# EAGLE design BMS-Shield rev1 (EAGLE 8.1.0)
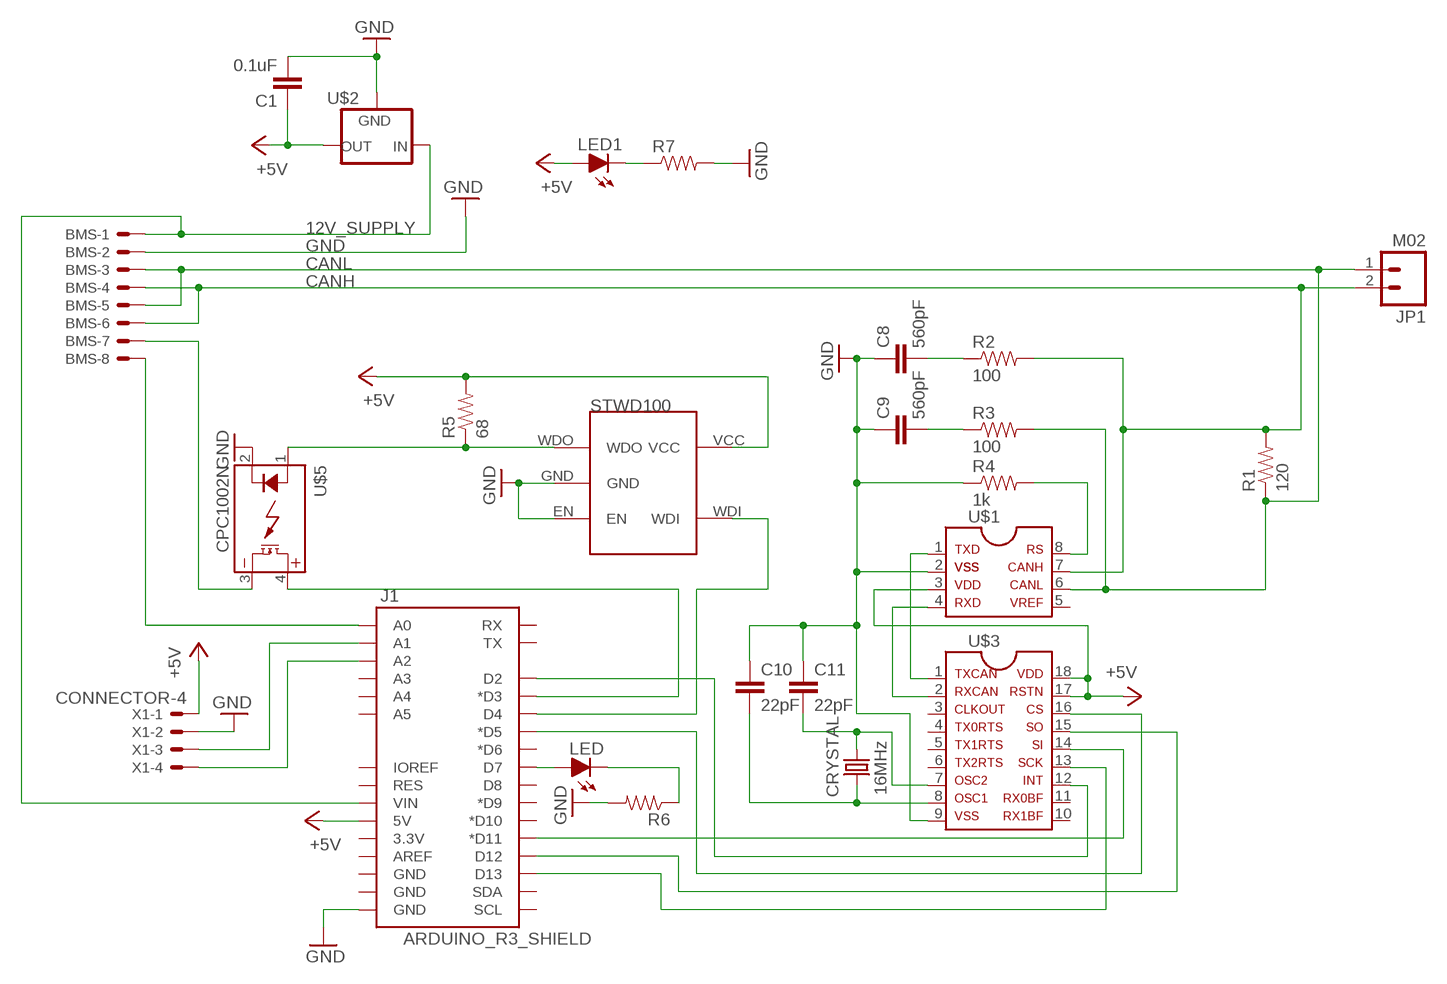
[diagram p0: schematic, sheet 1]

## Parts
BMS  MINIFIT_5566-8  [MINIFIT_5566-8]
C1  0.1uF  CAP0805  [0805]
C8  560pF  CAP0805  [0805]
C9  560pF  CAP0805  [0805]
C10  22pF  CAP0805  [0805]
C11  22pF  CAP0805  [0805]
CRYSTAL  16MHz  CRYSTALSMD  [HC49UP]
J1  ARDUINO_R3_SHIELD  [UNO_R3_SHIELD]
JP1  M02  [1X02]
LED  LED-0805  [LED-805]
LED1  LED-0805  [LED-805]
R1  120  RESISTOR0805-RES  [0805]
R2  100  RESISTOR0805-RES  [0805]
R3  100  RESISTOR0805-RES  [0805]
R4  1k  RESISTOR0805-RES  [0805]
R5  68  RESISTOR0805-RES  [0805]
R6  RESISTOR0805-RES  [0805]
R7  RESISTOR0805-RES  [0805]
U$1  MCP2551  [SOIC-08]
U$2  5VREG_LM340-NLM340MPX-5.0/NOPB  [SOT223]
U$3  MCP2515SMD  [SOIC-18W]
U$4  STWD100  [SOT23-5]
U$5  CPC1002N  [SOP04]
X1  CONNECTOR-4  [MINIFIT_5566-4]

## Nets
12V_SUPPLY: BMS.1 J1.VIN U$2.1(IN)
+5V: C1.1 J1.5V LED1.A R5.2 U$1.3 U$2.3(OUT) U$3.17 U$3.18 U$4.VCC X1.1
CANH: BMS.4 BMS.6 JP1.2 R1.2 R2.2 U$1.7
CANL: BMS.3 BMS.5 JP1.1 R1.1 R3.2 U$1.6
CS: J1.D5(*D5) U$3.16
GND: BMS.2 C1.2 C8.1 C9.1 C10.1 C11.1 J1.GND@0(GND) R4.1 R6.2 R7.2 U$1.2 U$2.2(GND) U$2.4(GND) U$3.9 U$4.EN U$4.GND U$5.2(CONTROL-) X1.2
N$1: BMS.8 J1.A0
N$2: J1.D12 U$3.15
N$3: J1.D11(*D11) U$3.14
N$4: J1.D13 U$3.13
N$5: R5.1 U$4.WDO U$5.1(CONTROL+)
N$6: J1.D4 U$4.WDI
N$7: J1.D7 LED.A
N$8: BMS.7 U$5.3(DC-)
N$9: J1.D3(*D3) U$5.4(DC+)
N$10: J1.D2 U$3.12
N$11: C10.2 CRYSTAL.2 U$3.8
N$12: U$1.1 U$3.1
N$13: U$1.4 U$3.2
N$14: C8.2 R2.1
N$15: C11.2 CRYSTAL.1 U$3.7
N$16: R4.2 U$1.8
N$17: C9.2 R3.1
N$18: LED.C R6.1
N$19: J1.A1 X1.3
N$20: J1.A2 X1.4
N$22: LED1.C R7.1
Unconnected: J1.3.3V J1.A3 J1.A4 J1.A5 J1.AREF J1.D6(*D6) J1.D8 J1.D9(*D9) J1.D10(*D10) J1.GND@1(GND) J1.GND@2(GND) J1.IOREF J1.RES J1.RX J1.SCL J1.SDA J1.TX U$1.5 U$3.3 U$3.4 U$3.5 U$3.6 U$3.10 U$3.11

## Library data of the parts
BMS = HyTechDevices:MINIFIT_5566-8: Mini-Fit Junior connector 8 pole Source: http://www.molex.com; OC_FARNELL: unknown; OC_NEWARK: unknown
C1 C8-C11 = HyTechDevices:CAP: Capacitor Standard 0603 ceramic capacitor, and 0.1" leaded capacitor.
CRYSTAL = SparkFun-FreqCtrl:CRYSTAL: Various standard crystals. Proven footprints.
J1 = HyTechDevices:ARDUINO_R3_SHIELD: Shield form compatible with the Arduino Uno R3. Source: Sparkfun <https://github.com/sparkfun/SparkFun-Eagle-Libraries>
JP1 = HyTechDevices:M02: Standard 2-pin 0.1" header. NOTES ON THE VARIANTS LOCK and LOCK_LONGPADS... This footprint was designed to help hold the alignment of a through-hole component (i.e. 6-pin header) while soldering it into place. You may notice that each hole has been shifted either up or down by 0.005 of an inch from it's more standard position (which is a perfectly straight line). This slight alteration caused the pins (the squares in the middle) to touch the edges of the holes. Because they are alternating, it causes a "brace" to hold the component in place. 0.005 has proven to be the perfect amount of "off-center" position when using our standard breakaway headers. Although looks a little odd when you look at the bare footprint, once you have a header in there, the alteration is very hard to notice. Also,if you push a header all the way into place, it is covered up entirely on the bottom side. This idea of altering the position of holes to aid alignment will be further integrated into the Sparkfun Library for other footprints. It can help hold any component with 3 or more connection pins. Note: The Sparkfun version includes many other packages including surface mount that may be of future interest. Source: Sparkfun <https://github.com/sparkfun/SparkFun-Eagle-Libraries>
LED LED1 = HyTechDevices:LED: Light Emitting Diode (LED) Source: Dangerous Prototypes Eagle Library <https://github.com/DangerousPrototypes/Eagle_Part_Library>
R1-R7 = HyTechDevices:RESISTOR: Resistor Basic schematic elements and footprints for 0603, 1206, and PTH resistors.
U$1 = HyTechDevices:MCP2551: MCP2551 High-Speed CAN Transceiver Product Webpage <https://www.microchip.com/wwwproducts/en/MCP2551> Datasheet <http://ww1.microchip.com/downloads/en/DeviceDoc/21667f.pdf> This device is outdated It is replaced by MCP2561. Comparison Page <https://www.microchip.com/wwwproducts/ProductCompare/MCP2551/MCP2561> Product Webpage <https://www.microchip.com/wwwproducts/en/MCP2561> Datasheet <http://ww1.microchip.com/downloads/en/DeviceDoc/20005167C.pdf>
U$2 = HyTechDevices:5VREG_LM340-N: Voltage Regulator 5v linear voltage regulator Datasheet <http://www.mouser.com/ProductDetail/Texas-Instruments/LM340MPX-50-NOPB/?qs=X1J7HmVL2ZGZwtTFRQ9ItA%3D%3D> MAX current out: 1.5A MAX voltage in: 35V
U$3 = HyTechDevices:MCP2515: MCP2515 CAN Controller with SPI Interface Datasheet <http://ww1.microchip.com/downloads/en/DeviceDoc/21801G.pdf>
U$4 = HyTechDevices:STWD100: STWD100 Watchdog timer
U$5 = HyTechDevices:CPC1002N: IXYS Solid State Relay .7A
X1 = HyTechDevices:CONNECTOR-4: Mini-Fit Junior connector 4 pole Source: http://www.molex.com; OC_FARNELL: unknown; OC_NEWARK: unknown

## Board
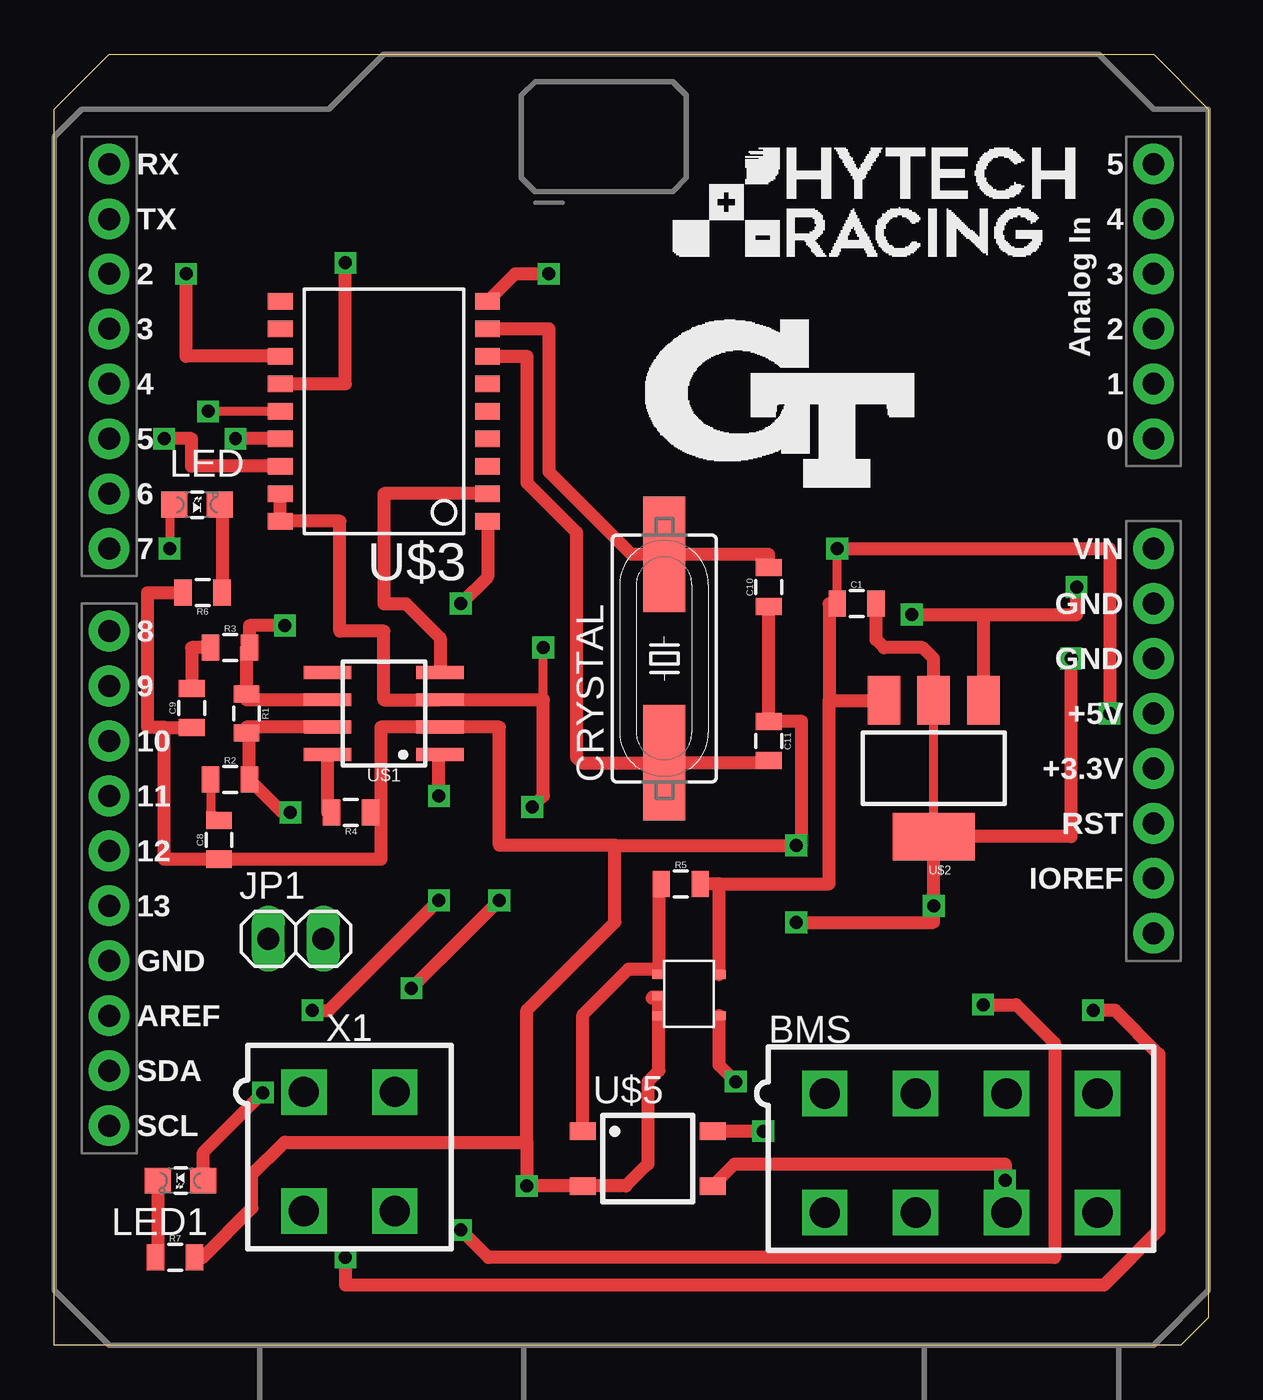
[diagram p1: board, top side]
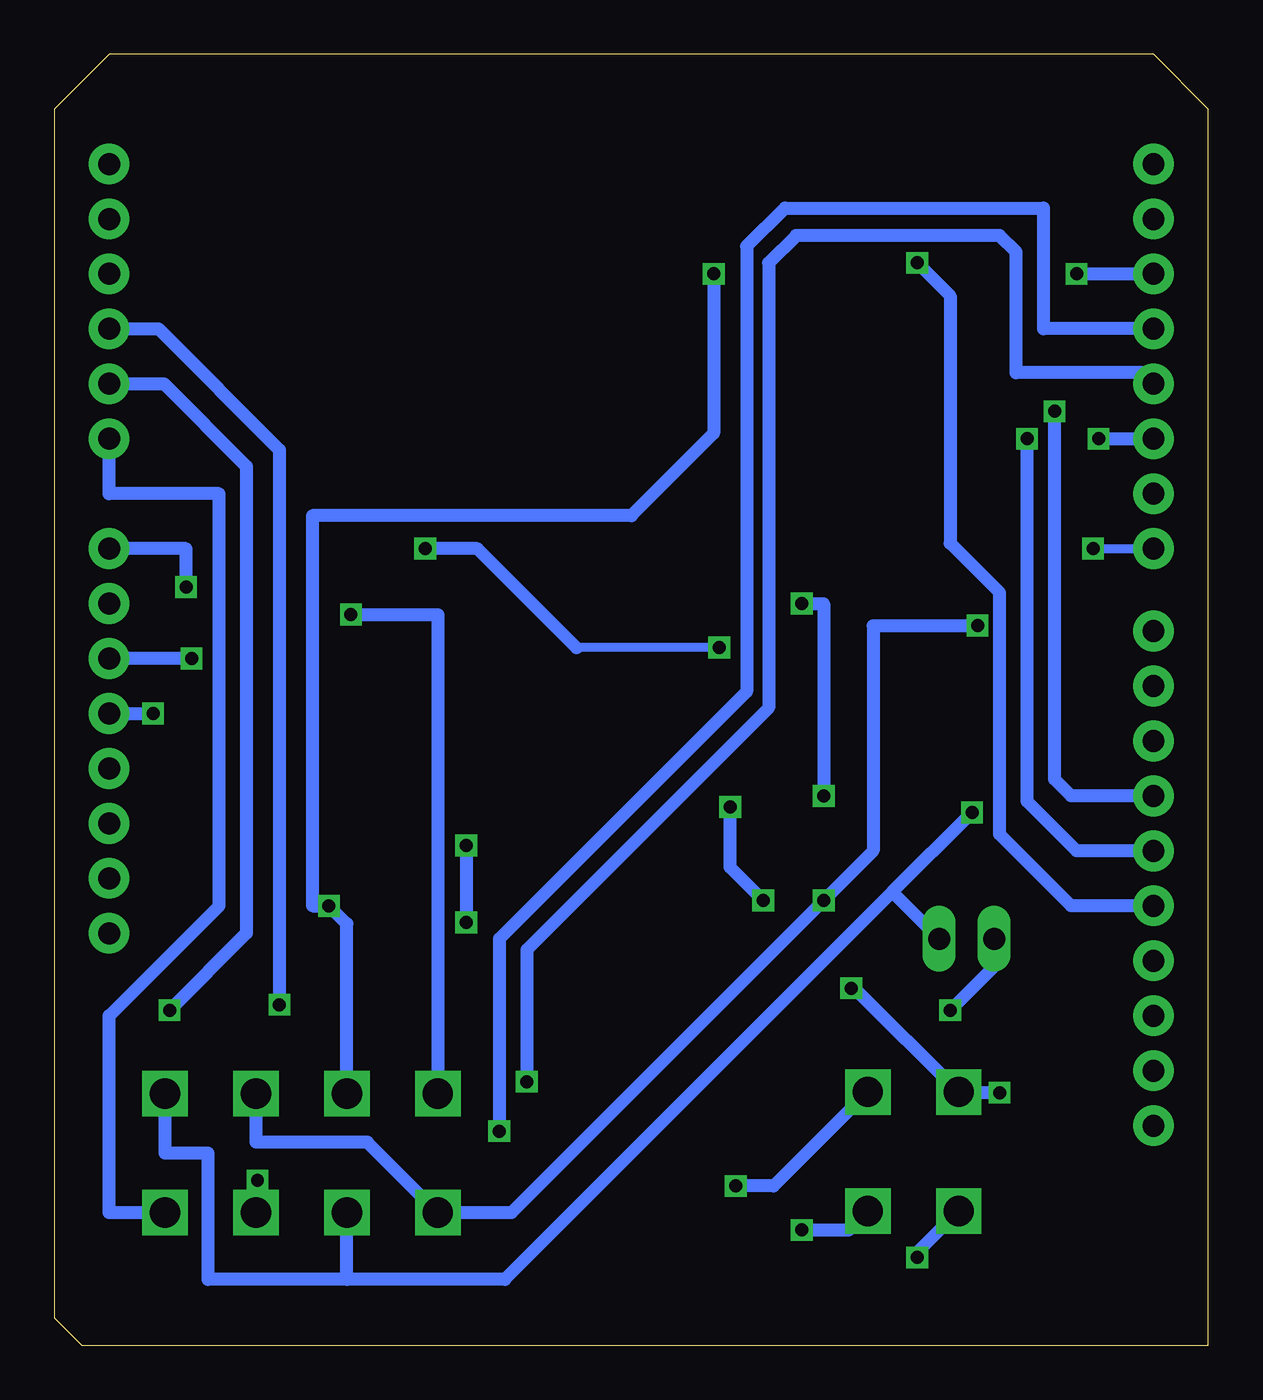
[diagram p2: board, bottom side, seen from below]

Size 53.34 x 59.69 mm. Coordinates in mm from the lower left corner, seen from the top.
Outline: 0,0 0,57.15 2.54,59.69 50.8,59.69 53.34,57.15 53.34,1.27 52.07,0 0,0
Copper layers (1*16): Top 0.035mm / dielectric 1.5mm / Bottom 0.035mm
Design rules "default": minimum track width 10mil, minimum drill 24mil, track to track 8mil, track to pad 8mil, pad to pad 8mil, via to via 8mil, smd to smd 8mil, copper to edge 40mil, drill to drill 8mil, minimum pad ring 10mil, minimum via ring 8mil, stop-mask expansion 4mil, vias tented up to drill 0mil, thermal gap 10mil

### Footprints (pad centres in the part's own frame; a part is rotated, then mirrored left to right if it is on the bottom)
MINIFIT_5566-8 = drill 1.4 square: 1 6.3,-2.75; 2 2.1,-2.75; 3 -2.1,-2.75; 4 -6.3,-2.75; 5 6.3,2.75; 6 2.1,2.75; 7 -2.1,2.75; 8 -6.3,2.75
0805 = smd 0.8 x 1.2: 1 -0.9,0; 2 0.9,0
HC49UP = smd 5.334 x 1.93: 1 -4.826,0; 2 4.826,0
UNO_R3_SHIELD = drill 1.016 pad 1.88: 3.3V 50.8,26.67; 5V 50.8,29.21; A0 50.8,41.91; A1 50.8,44.45; A2 50.8,46.99; A3 50.8,49.53; A4 50.8,52.07; A5 50.8,54.61; AREF 2.54,15.24; D2 2.54,49.53; D3 2.54,46.99; D4 2.54,44.45; D5 2.54,41.91; D6 2.54,39.37; D7 2.54,36.83; D8 2.54,33.02; D9 2.54,30.48; D10 2.54,27.94; D11 2.54,25.4; D12 2.54,22.86; D13 2.54,20.32; GND@0 50.8,31.75; GND@1 50.8,34.29; GND@2 2.54,17.78; IOREF 50.8,21.59; NC 50.8,19.05; RES 50.8,24.13; RX 2.54,54.61; SCL 2.54,10.16; SDA 2.54,12.7; TX 2.54,52.07; VIN 50.8,36.83
1X02 = drill 1.016 long: 1 -1.27,0; 2 1.27,0
LED-805 = smd 1.2 x 1.2: A 0,-1.05; C 0,1.05
SOIC-08 = smd 0.6 x 2.2: 1 -1.905,-2.6; 2 -0.635,-2.6; 3 0.635,-2.6; 4 1.905,-2.6; 5 1.905,2.6; 6 0.635,2.6; 7 -0.635,2.6; 8 -1.905,2.6
SOT223 = smd 1.5 x 2.235: 1 -2.3,-3.15; 2 0,-3.15; 3 2.3,-3.15 | smd 3.8 x 2.2: 4 0,3.15
SOIC-18W = smd 0.762 x 1.143: 1 -5.08,-4.788; 2 -3.81,-4.788; 3 -2.54,-4.788; 4 -1.27,-4.788; 5 0,-4.788; 6 1.27,-4.788; 7 2.54,-4.788; 8 3.81,-4.788; 9 5.08,-4.788; 10 5.08,4.788; 11 3.81,4.788; 12 2.54,4.788; 13 1.27,4.788; 14 0,4.788; 15 -1.27,4.788; 16 -2.54,4.788; 17 -3.81,4.788; 18 -5.08,4.788
SOT23-5 = smd 0.61 x 0.406: EN -2.794,0; GND -2.794,0.94; VCC 0,1.905; WDI 0,0; WDO -2.794,1.905
SOP04 = smd 0.8 x 1.2: 1 -1.27,-3; 2 1.27,-3; 3 1.27,3; 4 -1.27,3
MINIFIT_5566-4 = drill 1.4 square: 1 2.1,-2.75; 2 -2.1,-2.75; 3 2.1,2.75; 4 -2.1,2.75

### Placement (x,y rotation side)
BMS  41.91,8.89 180 top
C1  37.08,34.29 0 top
C8  7.62,23.37 90 top
C9  6.35,29.46 90 top
C10  33.02,35.05 90 top
C11  33.02,27.94 270 top
CRYSTAL  28.19,31.75 90 top
J1  0,0 0 top
JP1  11.18,18.8 0 top
LED  6.6,38.86 270 top
LED1  5.84,7.62 90 top
R1  8.89,29.21 270 top
R2  8.13,26.16 0 top
R3  8.13,32.26 0 top
R4  13.72,24.64 180 top
R5  28.96,21.34 0 top
R6  6.86,34.8 180 top
R7  5.59,4.06 0 top
U$1  15.24,29.21 90 top
U$2  40.64,26.67 180 top
U$3  15.24,43.18 90 top
U$4  30.73,15.24 0 top
U$5  27.43,8.64 270 top
X1  13.64,8.97 180 top

### Tracks (layer width: path | path; a pad name or v marks a point on that pad's centre or on a via)
12V_SUPPLY  (via drill 0.6)
  Top 0.61: v39.62,33.78 42.94,33.78 | 42.94,33.78 U$2.1 | 42.94,33.78 47.24,33.78 v47.24,35.05
  Bottom 0.61: v39.62,33.78 35.61,33.78 BMS.1 | v47.24,35.05 47.24,36.83 J1.VIN
+5V  (via drill 0.6)
  Top 0.406: U$2.3 38.47,29.82 | C1.1 v36.18,36.83 | 22.61,29.84 v22.61,32.26
  Top 0.61: U$4.VCC 30.73,21.34 | 30.73,21.34 R5.2 | 35.81,29.82 U$2.3 | 30.73,21.34 35.81,21.34 35.81,29.82 | U$3.17 U$3.18 13.21,38.1 13.21,33.02 15.24,33.02 15.24,29.84 U$1.3 22.61,29.84 22.61,25.4 v22.1,24.89 | C1.1 35.81,34.29 35.81,29.82 | v36.18,36.83 48.77,36.83 v48.77,29.21 | v16.51,16.51 v20.57,20.57 | LED1.A 6.89,8.92 v9.65,11.68
  Bottom 0.406: v22.61,32.26 29.21,32.26
  Bottom 0.61: v36.18,36.83 33.78,36.83 29.21,32.26 | J1.5V v48.77,29.21 | v16.51,16.51 16.33,16.51 X1.1 11.51,11.68 v9.65,11.68 | v20.57,20.57 22.1,22.1 v22.1,24.89
CANH  (via drill 0.6)
  Top 0.406: 8.89,28.57 R1.2 9.03,28.31 | v10.92,24.64 10.55,24.64
  Top 0.61: U$1.7 8.89,28.57 | 9.03,28.31 R2.2 10.55,24.64
  Bottom 0.61: 39.81,3.05 BMS.6 | BMS.4 48.21,8.89 46.23,8.89 46.23,3.05 39.81,3.05 | 14.61,20.95 v10.92,24.64 | 14.61,20.95 32.51,3.05 39.81,3.05 | JP1.2 14.61,20.95
CANL  (via drill 0.6)
  Top 0.406: R1.1 8.89,29.84 | R3.2 8.89,32.26
  Top 0.61: U$1.6 8.89,29.84 | 8.89,32.26 R1.1 | v10.67,33.27 9.03,33.27 R3.2 | v11.94,15.49 12.7,15.49 v17.78,20.57
  Bottom 0.61: BMS.3 44.01,9.4 38.87,9.4 BMS.5 32.21,6.14 v17.78,20.57 15.49,22.86 15.49,33.27 v10.67,33.27 | JP1.1 9.91,17.53 v11.94,15.49
CS  (via drill 0.6)
  Top 0.61: U$3.16 6.35,40.64 6.35,41.91 v5.08,41.91
  Bottom 0.61: v5.08,41.91 J1.D5
GND  (via drill 0.6)
  Top 0.406: 40.27,29.82 U$2.2 U$2.4 | 15.11,24.64 R4.1 | U$4.GND 27.64,16.18 27.64,16.05
  Top 0.61: v46.99,31.75 46.99,23.52 U$2.4 v40.64,20.32 40.64,19.56 v34.29,19.56 | C10.1 C11.1 34.54,28.84 34.54,23.11 v34.29,23.11 25.91,23.11 | 25.91,23.11 20.57,23.11 20.57,28.57 U$1.2 15.11,28.57 15.11,24.64 15.11,22.47 C8.1 5.08,22.47 5.08,28.56 | 21.84,9.4 v21.84,7.37 U$5.2 26.42,7.37 27.43,8.38 27.43,12.19 27.94,12.7 U$4.EN 27.94,16.05 27.64,16.05 | 21.84,9.4 21.84,15.49 25.91,19.56 25.91,23.11 | U$3.9 21.3,49.53 v22.86,49.53 | U$2.2 40.64,31.75 40.13,32.26 38.35,32.26 37.98,32.63 C1.2 | R6.2 4.32,34.8 4.32,28.56 5.08,28.56 | 5.08,28.56 C9.1 | R7.2 6.86,4.06 9.14,6.35 9.14,7.87 10.67,9.4 21.84,9.4
  Bottom 0.61: v46.99,31.75 J1.GND@0 | BMS.2 39.81,19.49 v40.64,20.32 41.4,20.32 41.4,38.35 26.67,38.35 22.86,42.16 v22.86,49.53 | v34.29,23.11 v34.29,19.56 | X1.2 20.09,7.37 v21.84,7.37
N$1
  Bottom 0.61: BMS.8 50.8,6.14 50.8,15.24 45.72,20.32 45.72,39.37 50.8,39.37 J1.A0
N$2  (via drill 0.6)
  Top 0.61: U$3.15 v8.38,41.91
  Bottom 0.61: v8.38,41.91 8.38,25.15 6.1,22.86 J1.D12
N$3  (via drill 0.6)
  Top 0.406: v7.11,43.18 U$3.14
  Bottom 0.61: v7.11,43.18 7.11,26.16 6.35,25.4 J1.D11
N$4  (via drill 0.6)
  Top 0.61: U$3.13 13.46,44.45 v13.46,50.04
  Bottom 0.61: v13.46,50.04 11.94,48.51 11.94,37.08 9.65,34.8 9.65,23.62 6.35,20.32 J1.D13
N$5
  Top 0.406: 27.94,21.34 R5.1 | 27.94,17.4 U$4.WDO
  Top 0.61: 27.94,21.34 27.94,17.4 26.54,17.4 24.43,15.29 U$5.1
N$6  (via drill 0.6)
  Top 0.61: v31.5,12.19 30.73,12.95 U$4.WDI
  Bottom 0.61: J1.D4 3.05,44.96 8.89,44.96 8.89,50.55 9.65,51.31 19.05,51.31 20.32,50.04 20.32,29.46 31.5,18.29 v31.5,12.19
N$7  (via drill 0.6)
  Top 0.406: LED.A 5.33,38.86 v5.33,36.83
  Bottom 0.406: v5.33,36.83 J1.D7
N$8  (via drill 0.6)
  Top 0.61: U$5.3 31.45,8.38 43.94,8.38 v43.94,7.62
  Bottom 0.61: v43.94,7.62 44.01,7.55 BMS.7
N$9  (via drill 0.6)
  Top 0.61: v32.77,9.91 U$5.4
  Bottom 0.61: J1.D3 7.62,46.99 7.62,52.58 19.56,52.58 21.34,50.8 21.34,30.23 32.77,18.8 v32.77,9.91
N$10  (via drill 0.6)
  Top 0.61: U$3.12 6.1,45.72 v6.1,49.53
  Bottom 0.61: v6.1,49.53 J1.D2
N$11
  Top 0.61: U$3.8 22.86,46.99 22.86,40.39 26.67,36.58 CRYSTAL.2 33.02,36.58 C10.2
N$12  (via drill 0.6)
  Top 0.406: 20.07,38.1 U$3.1
  Top 0.61: v17.78,25.4 17.78,27.3 U$1.1 | U$3.1 20.03,35.52 v18.8,34.29
  Bottom 0.61: v18.8,34.29 17.78,34.29 v17.78,25.4
N$13
  Top 0.61: U$3.2 15.24,39.37 15.24,34.29 16.26,34.29 17.84,32.71 U$1.4
N$14
  Top 0.406: C8.2 7.23,24.66 R2.1
N$15
  Top 0.406: C11.2 33.02,26.92
  Top 0.61: U$3.7 21.84,45.72 21.84,39.88 24.13,37.59 24.13,27.18 24.38,26.92 CRYSTAL.1 33.02,26.92
N$16
  Top 0.406: R4.2 12.64,24.64
  Top 0.61: 12.64,24.64 U$1.8
N$17
  Top 0.406: 7.23,32.4 R3.1
  Top 0.61: R3.1 6.35,32.26 C9.2
N$18
  Top 0.406: LED.C 7.76,38.86
  Top 0.61: 7.76,38.86 R6.1
N$19  (via drill 0.6)
  Top 0.61: v13.46,4.06 13.46,2.79 48.51,2.79 51.05,5.33 51.05,13.46 49.02,15.49 v48.01,15.49
  Bottom 0.61: J1.A1 48.26,44.45 44.45,40.64 44.45,19.05 v48.01,15.49 | v13.46,4.06 13.46,4.29 X1.3
N$20  (via drill 0.6)
  Top 0.61: v42.93,15.75 44.45,15.75 46.23,13.97 46.23,4.06 20.07,4.06 v18.8,5.33
  Bottom 0.61: J1.A2 48.51,46.99 42.93,41.4 v42.93,15.75 | v18.8,5.33 16.62,5.33 X1.4
N$22
  Top 0.61: LED1.C 4.79,4.17 R7.1

### Text on the board
tDocu: HyTech 2017 BMS Shield rev1